# Altium schematic sheet motor-driver-v5.0-connector.SchDoc
size A
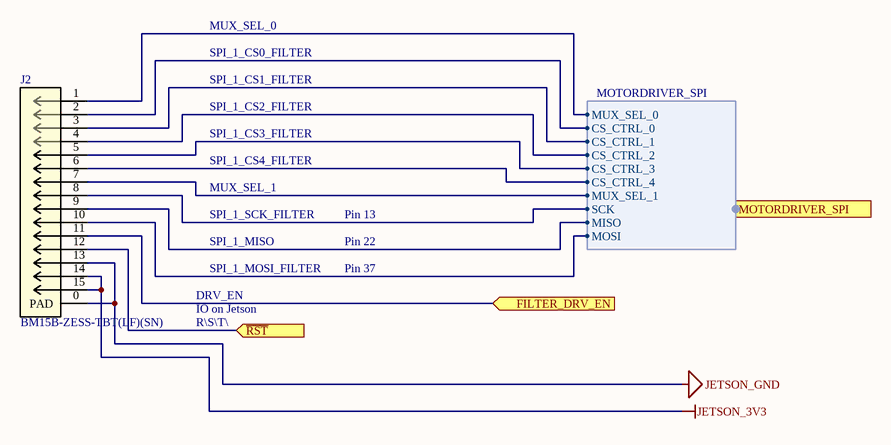
[diagram p0: motor-driver-v5.0-connector.SchDoc]

## Parts
J2  BM15B-ZESS-TBT(LF)(SN)  [JST ZE SMT 15POS]

## Ports
FILTER_DRV_EN (in), MOTORDRIVER_SPI (harness MOTORDRIVER_SPI), ~{RST} (in)

## Harnesses
MOTORDRIVER_SPI: CS_CTRL_0, MUX_SEL_1, SCK, MOSI, MISO, CS_CTRL_1, CS_CTRL_2, CS_CTRL_3, CS_CTRL_4, MUX_SEL_0

## Nets
JETSON_3V3: J2.14 J2.15
JETSON_GND: J2.0(PAD) J2.13
FILTER_DRV_EN: J2.11 ; port FILTER_DRV_EN
~{RST}: J2.12 ; port ~{RST}
NetJ2_1: J2.1 ; port MOTORDRIVER_SPI.MUX_SEL_0
NetJ2_2: J2.2 ; port MOTORDRIVER_SPI.CS_CTRL_0
NetJ2_3: J2.3 ; port MOTORDRIVER_SPI.CS_CTRL_1
NetJ2_4: J2.4 ; port MOTORDRIVER_SPI.CS_CTRL_2
NetJ2_5: J2.5 ; port MOTORDRIVER_SPI.CS_CTRL_3
NetJ2_6: J2.6 ; port MOTORDRIVER_SPI.CS_CTRL_4
NetJ2_7: J2.7 ; port MOTORDRIVER_SPI.MUX_SEL_1
NetJ2_8: J2.8 ; port MOTORDRIVER_SPI.SCK
NetJ2_9: J2.9 ; port MOTORDRIVER_SPI.MISO
NetJ2_10: J2.10 ; port MOTORDRIVER_SPI.MOSI

## Notes on the sheet
- SPI_1_CS0_FILTER
- MUX_SEL_0
- SPI_1_CS1_FILTER
- SPI_1_CS2_FILTER
- SPI_1_CS3_FILTER
- SPI_1_CS4_FILTER
- MUX_SEL_1
- SPI_1_SCK_FILTER
- SPI_1_MISO
- SPI_1_MOSI_FILTER
- Pin 37
- Pin 22
- Pin 13
- IO on Jetson
- DRV_EN
- R\S\T\

## Library data of the parts
J2 = CN 15POS JST ZE SMT: CONN HEADER VERT SMD 15POS ZE; Supplier 1: Digi-Key; Supplier Part Number 1: 455-4211-1-ND; Part Number: CN 15POS JST ZE SMT; Manufacturer Part Number 1: BM15B-ZESS-TBT(LF)(SN); Supplier URL 1: https://www.digikey.ca/en/products/detail/jst-sales-america-inc/BM15B-ZESS-TBT-LF-SN/1886999?s=N4IgTCBcDaIEIFkCMBWOBaAWgUQMq-QBU5CAKAGQDEBKU3AOWpAF0BfIA; Pin Count: 15